# Altium schematic sheet Sheet2.SchDoc
size A; SheetNumber: 1; SheetTotal: 2
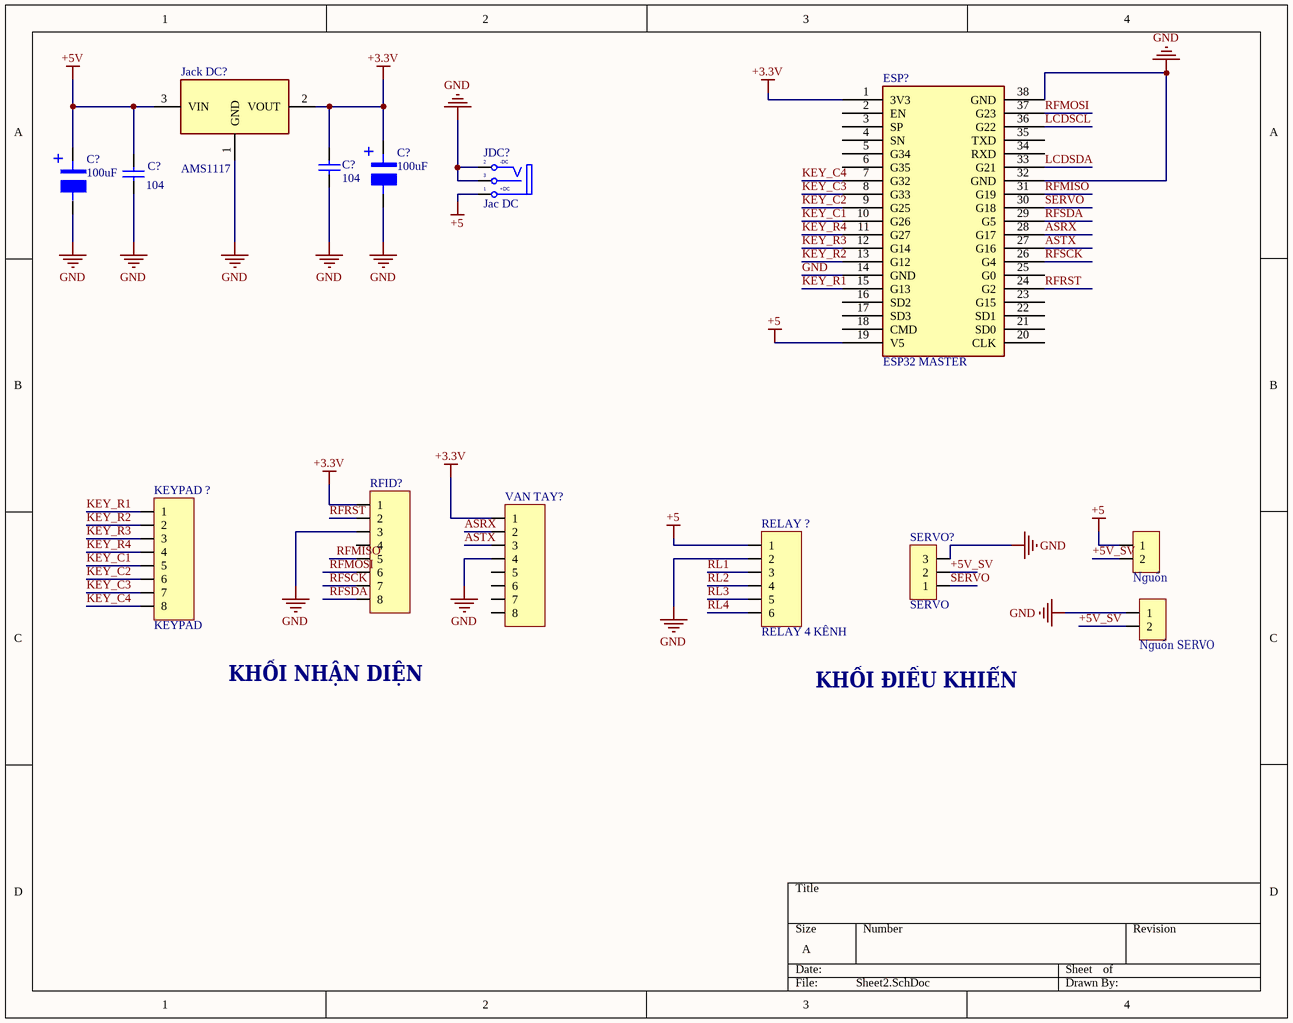
[diagram p0: Sheet2.SchDoc]

## Parts
(Parts that share a designator on the sheet are numbered #1, #2 ... from top to bottom, then left to right.)
C?#1  100uF  [100UF/16V_SMD]
C?#2  100uF  [100UF/16V_SMD]
C?#3  104  [tu 1206]
C?#4  104  [tu 1206]
ESP?  ESP32 MASTER  [ESP32_38]
Jack_DC?  AMS1117  [AMS1117]
JDC?  Jac DC  [DC-IN]
KEYPAD_?  KEYPAD  [JP 1x8 DT]
NGUON_SV?#1  Nguồn  [JP 1x2 DC]
NGUON_SV?#2  Nguồn SERVO  [JP 1x2 DC]
RELAY_?  RELAY 4 KÊNH  [JP 1x6 DC]
RFID?  JP 1x8 2.54  [JP 1x8 CT]  (value not drawn)
SERVO?  SERVO  [JP 1x3 DC]
VAN_TAY?  JP 1x8 2.54  [JP 1x8 DT]  (value not drawn)

## Nets
+3.3V: C?#1.1 C?#3.1 ESP?.1(3V3) Jack_DC?.2(VOUT) RFID?.1 VAN_TAY?.1
+5: ESP?.19(V5) JDC?.1(T) NGUON_SV?#1.1 RELAY_?.1
+5V: C?#2.1 C?#4.1 Jack_DC?.3(VIN)
GND: C?#1.2 C?#2.2 C?#3.2 C?#4.2 ESP?.14(GND) ESP?.32(GND) ESP?.38(GND) Jack_DC?.1(GND) JDC?.2(TN) JDC?.3(S) NGUON_SV?#2.1 RELAY_?.2 RFID?.3 SERVO?.3 VAN_TAY?.4
+5V_SV: NGUON_SV?#1.2 NGUON_SV?#2.2 SERVO?.2
ASRX: ESP?.28(G17) VAN_TAY?.2
ASTX: ESP?.27(G16) VAN_TAY?.3
KEY_C1: ESP?.10(G26) KEYPAD_?.5
KEY_C2: ESP?.9(G25) KEYPAD_?.6
KEY_C3: ESP?.8(G33) KEYPAD_?.7
KEY_C4: ESP?.7(G32) KEYPAD_?.8
KEY_R1: ESP?.15(G13) KEYPAD_?.1
KEY_R2: ESP?.13(G12) KEYPAD_?.2
KEY_R3: ESP?.12(G14) KEYPAD_?.3
KEY_R4: ESP?.11(G27) KEYPAD_?.4
LCDSCL: ESP?.36(G22)
LCDSDA: ESP?.33(G21)
RFMISO: ESP?.31(G19) RFID?.5
RFMOSI: ESP?.37(G23) RFID?.6
RFRST: ESP?.24(G2) RFID?.2
RFSCK: ESP?.26(G4) RFID?.7
RFSDA: ESP?.29(G5) RFID?.8
RL1: RELAY_?.3
RL2: RELAY_?.4
RL3: RELAY_?.5
RL4: RELAY_?.6
SERVO: ESP?.30(G18) SERVO?.1

Not connected (* = marked no-connect by the designer): ESP? 2(EN) 3(SP) 4(SN) 5(G34) 6(G35) 16(SD2) 17(SD3) 18(CMD) 20(CLK) 21(SD0) 22(SD1) 23(G15) 25(G0) 34(RXD) 35(TXD); RFID? 4; VAN_TAY? 5 6 7 8

## Notes on the sheet
- KHỐI NHẬN DIỆN
- KHỐI ĐIỀU KHIỂN
- (in symbol Cap100uF_SMD) +
- (in symbol DCIN) -DC; +DC

## Library data of the parts
C?#1 C?#2 = Cap100uF_SMD: Value: 100uF
C?#3 C?#4 = Tu 1206 104 50V 20%: Dán; Don_Vi: Con; So_Chan: 2; Ten_Linh_Kien: Tụ 1206 104-0.1uF 20% 50V; Ma_Hang: MH004544; Chung_Loai: Dán; Kieu_Chan: *
ESP? = ESP32_38: Microcontoller Board 38 Pins Wifi 2.4GHz BLE 4.2 ESP32-WROOM-32D; ComponentLink1Description: Datasheet; ComponentLink1URL: https://www.mouser.com/datasheet/2/891/esp32_wroom_32d_esp32_wroom_32u_datasheet_en-1365844.pdf
Jack_DC? = AMS1117: IC REG LINEAR 1A SOT-89-3L; ComponentLink1Description: Datasheet; ComponentLink1URL: http://www.advanced-monolithic.com/pdf/ds1117.pdf; Digikey PN: 4518-AMS1117-3.3CT-ND; JLCPCB PN: C963410
JDC? = DCIN: Jac DC input; Value: Jac DC
KEYPAD_? VAN_TAY? = JP 1x8 2.54 Duc Thang: Cắm; Ten_Linh_Kien: Jump Đơn Đực 2.54MM 1x40P Thẳng 11MM; Don_Vi: Con; Ma_Hang: MH000903; Ghi_Chu: *; Kieu_Chan: *; Chung_Loai: Cắm
NGUON_SV?#1 NGUON_SV?#2 = JP 1x2 2.54 Duc Cong: Cắm; Ten_Linh_Kien: Jump Đơn Đực 2.54MM 1x40P Cong Đứng; Don_Vi: Con; Ma_Hang: MH000904; Ghi_Chu: *; Kieu_Chan: *; Chung_Loai: Cắm
RELAY_? = JP 1x6 2.54 Duc Cong: Cắm; Ten_Linh_Kien: Jump Đơn Đực 2.54MM 1x40P Cong Đứng; Don_Vi: Con; Ma_Hang: MH000904; Ghi_Chu: *; Kieu_Chan: *; Chung_Loai: Cắm
RFID? = JP 1x8 2.54 Cai Thang: Cắm; Ten_Linh_Kien: Jump Đơn Cái 2.54MM 1x20P Thẳng; Don_Vi: Con; Ma_Hang: MH004006; Ghi_Chu: *; Kieu_Chan: *; Chung_Loai: Cắm
SERVO? = JP 1x3 2.54 Duc Cong: Cắm; Ten_Linh_Kien: Jump Đơn Đực 2.54MM 1x40P Cong Đứng; Don_Vi: Con; Ma_Hang: MH000904; Ghi_Chu: *; Kieu_Chan: *; Chung_Loai: Cắm